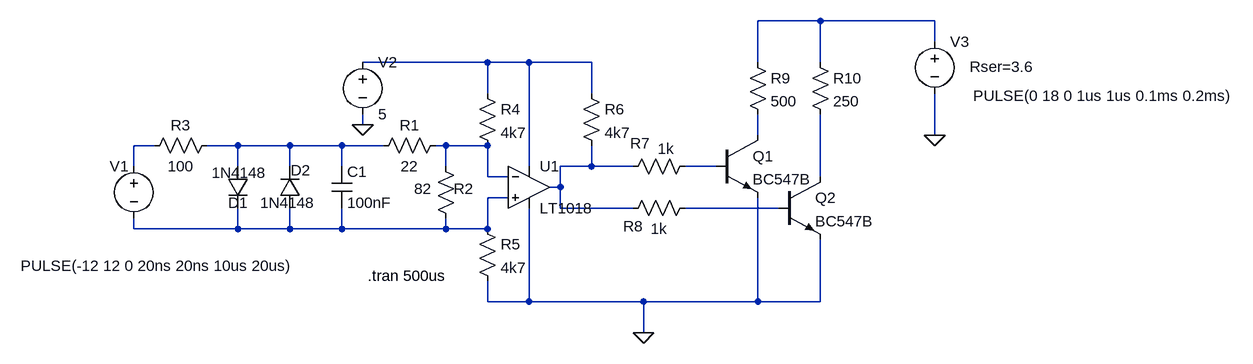
[diagram p0: schematic mfx-link.asc]
mfx-link.asc, the LTspice schematic file:
Version 4
SHEET 1 1668 680
WIRE 1024 -80 928 -80
WIRE 1200 -80 1024 -80
WIRE 1200 -48 1200 -80
WIRE 512 -16 320 -16
WIRE 576 -16 512 -16
WIRE 672 -16 576 -16
WIRE 928 -16 928 -80
WIRE 1024 -16 1024 -80
WIRE 512 32 512 -16
WIRE 672 32 672 -16
WIRE 320 80 320 64
WIRE 928 96 928 64
WIRE 1200 96 1200 32
WIRE 0 112 -32 112
WIRE 128 112 80 112
WIRE 208 112 128 112
WIRE 288 112 208 112
WIRE 352 112 288 112
WIRE 448 112 432 112
WIRE 512 112 448 112
WIRE -32 144 -32 112
WIRE 128 144 128 112
WIRE 208 144 208 112
WIRE 288 144 288 112
WIRE 448 144 448 112
WIRE 576 144 576 -16
WIRE 672 144 672 112
WIRE 672 144 624 144
WIRE 736 144 672 144
WIRE 864 144 816 144
WIRE 512 160 512 112
WIRE 544 160 512 160
WIRE 1024 160 1024 64
WIRE 624 176 624 144
WIRE 624 176 608 176
WIRE 544 192 512 192
WIRE 624 208 624 176
WIRE 736 208 624 208
WIRE 960 208 816 208
WIRE -32 240 -32 224
WIRE 128 240 128 208
WIRE 128 240 -32 240
WIRE 208 240 208 208
WIRE 208 240 128 240
WIRE 288 240 288 208
WIRE 288 240 208 240
WIRE 448 240 448 224
WIRE 448 240 288 240
WIRE 512 240 512 192
WIRE 512 240 448 240
WIRE 512 352 512 320
WIRE 576 352 576 208
WIRE 576 352 512 352
WIRE 752 352 576 352
WIRE 928 352 928 192
WIRE 928 352 752 352
WIRE 1024 352 1024 256
WIRE 1024 352 928 352
WIRE 752 400 752 352
FLAG 752 400 0
FLAG 320 80 0
FLAG 1200 96 0
SYMBOL diode 112 144 R0
WINDOW 0 1 56 Left 2
WINDOW 3 -24 10 Left 2
SYMATTR InstName D1
SYMATTR Value 1N4148
SYMBOL diode 224 208 R180
WINDOW 0 -16 58 Left 2
WINDOW 3 -23 8 Left 2
SYMATTR InstName D2
SYMATTR Value 1N4148
SYMBOL cap 272 144 R0
SYMATTR InstName C1
SYMATTR Value 100nF
SYMBOL res 448 96 R90
WINDOW 0 0 56 VBottom 2
WINDOW 3 32 56 VTop 2
SYMATTR InstName R1
SYMATTR Value 22
SYMBOL res 464 240 R180
WINDOW 0 -27 62 Left 2
WINDOW 3 38 62 Left 2
SYMATTR InstName R2
SYMATTR Value 82
SYMBOL voltage -32 128 R0
WINDOW 3 -174 169 Left 2
WINDOW 123 0 0 Left 2
WINDOW 39 -174 197 Left 2
WINDOW 0 -37 16 Left 2
SYMATTR Value PULSE(-12 12 0 20ns 20ns 10us 20us)
SYMATTR InstName V1
SYMBOL res 96 96 R90
WINDOW 0 0 56 VBottom 2
WINDOW 3 32 56 VTop 2
SYMATTR InstName R3
SYMATTR Value 100
SYMBOL res 496 16 R0
SYMATTR InstName R4
SYMATTR Value 4k7
SYMBOL res 496 224 R0
SYMATTR InstName R5
SYMATTR Value 4k7
SYMBOL res 656 16 R0
SYMATTR InstName R6
SYMATTR Value 4k7
SYMBOL res 832 128 R90
WINDOW 0 -4 85 VBottom 2
WINDOW 3 -27 45 VTop 2
SYMATTR InstName R7
SYMATTR Value 1k
SYMBOL res 832 192 R90
WINDOW 0 60 96 VBottom 2
WINDOW 3 32 56 VTop 2
SYMATTR InstName R8
SYMATTR Value 1k
SYMBOL npn 864 96 R0
SYMATTR InstName Q1
SYMATTR Value BC547B
SYMBOL npn 960 160 R0
SYMATTR InstName Q2
SYMATTR Value BC547B
SYMBOL voltage 320 -32 R0
WINDOW 123 0 0 Left 2
WINDOW 39 0 0 Left 2
SYMATTR InstName V2
SYMATTR Value 5
SYMBOL voltage 1200 -64 R0
WINDOW 3 59 99 Left 2
WINDOW 123 0 0 Left 2
WINDOW 39 54 55 Left 2
SYMATTR Value PULSE(0 18 0 1us 1us 0.1ms 0.2ms)
SYMATTR SpiceLine Rser=3.6
SYMATTR InstName V3
SYMBOL res 912 -32 R0
SYMATTR InstName R9
SYMATTR Value 500
SYMBOL res 1008 -32 R0
SYMATTR InstName R10
SYMATTR Value 250
SYMBOL Comparators\\LT1018 576 176 R0
SYMATTR InstName U1
TEXT 328 312 Left 2 !.tran 500us

The netlist it stands for:
* mfx-link.asc
D1 N005 N010 1N4148
D2 N010 N005 1N4148
C1 N005 N010 100nF
R1 N006 N005 22
R2 N010 N006 82
V1 N004 N010 PULSE(-12 12 0 20ns 20ns 10us 20us)
R3 N005 N004 100
R4 N002 N006 4k7
R5 N010 0 4k7
R6 N002 N007 4k7
R7 N008 N007 1k
R8 N011 N007 1k
Q1 N003 N008 0 0 BC547B
Q2 N009 N011 0 0 BC547B
V2 N002 0 5
V3 N001 0 PULSE(0 18 0 1us 1us 0.1ms 0.2ms) Rser=3.6
R9 N001 N003 500
R10 N001 N009 250
XU1 N010 N006 N002 0 N007 LT1018  ; pins In+ In- V+ V- OUT
.model D D
.lib standard.dio
.model NPN NPN
.model PNP PNP
.lib standard.bjt
.tran 500us
.lib LTC1.lib
.backanno
.end